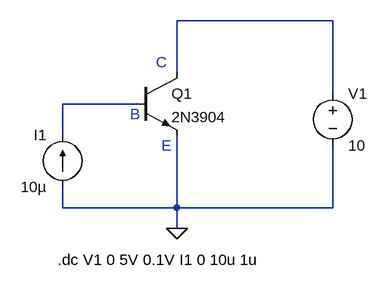
[diagram p0: schematic bjt.asc]
bjt.asc, the LTspice schematic file:
Version 4
SHEET 1 880 680
WIRE 496 -48 256 -48
WIRE 256 32 256 -48
WIRE 496 64 496 -48
WIRE 192 80 80 80
WIRE 80 128 80 80
WIRE 80 240 80 208
WIRE 256 240 256 128
WIRE 256 240 80 240
WIRE 496 240 496 144
WIRE 496 240 256 240
WIRE 256 272 256 240
FLAG 256 272 0
SYMBOL current 80 208 R180
WINDOW 0 24 80 Left 2
WINDOW 3 24 0 Left 2
WINDOW 123 0 0 Left 2
WINDOW 39 0 0 Left 2
SYMATTR InstName I1
SYMATTR Value 10µ
SYMBOL npn 192 32 R0
SYMATTR InstName Q1
SYMATTR Value 2N3904
SYMBOL voltage 496 48 R0
WINDOW 123 0 0 Left 2
WINDOW 39 0 0 Left 2
SYMATTR InstName V1
SYMATTR Value 10
TEXT 72 320 Left 2 !.dc V1 0 5V 0.1V I1 0 10u 1u
TEXT 224 16 Left 2 ;C
TEXT 184 96 Left 2 ;B
TEXT 232 144 Left 2 ;E

The netlist it stands for:
* bjt.asc
I1 0 N002 10µ
Q1 N001 N002 0 0 2N3904
V1 N001 0 10
.model NPN NPN
.model PNP PNP
.lib standard.bjt
.dc V1 0 5V 0.1V I1 0 10u 1u
* C
* B
* E
.backanno
.end